# EAGLE schematic klon (EAGLE 9.6.2)
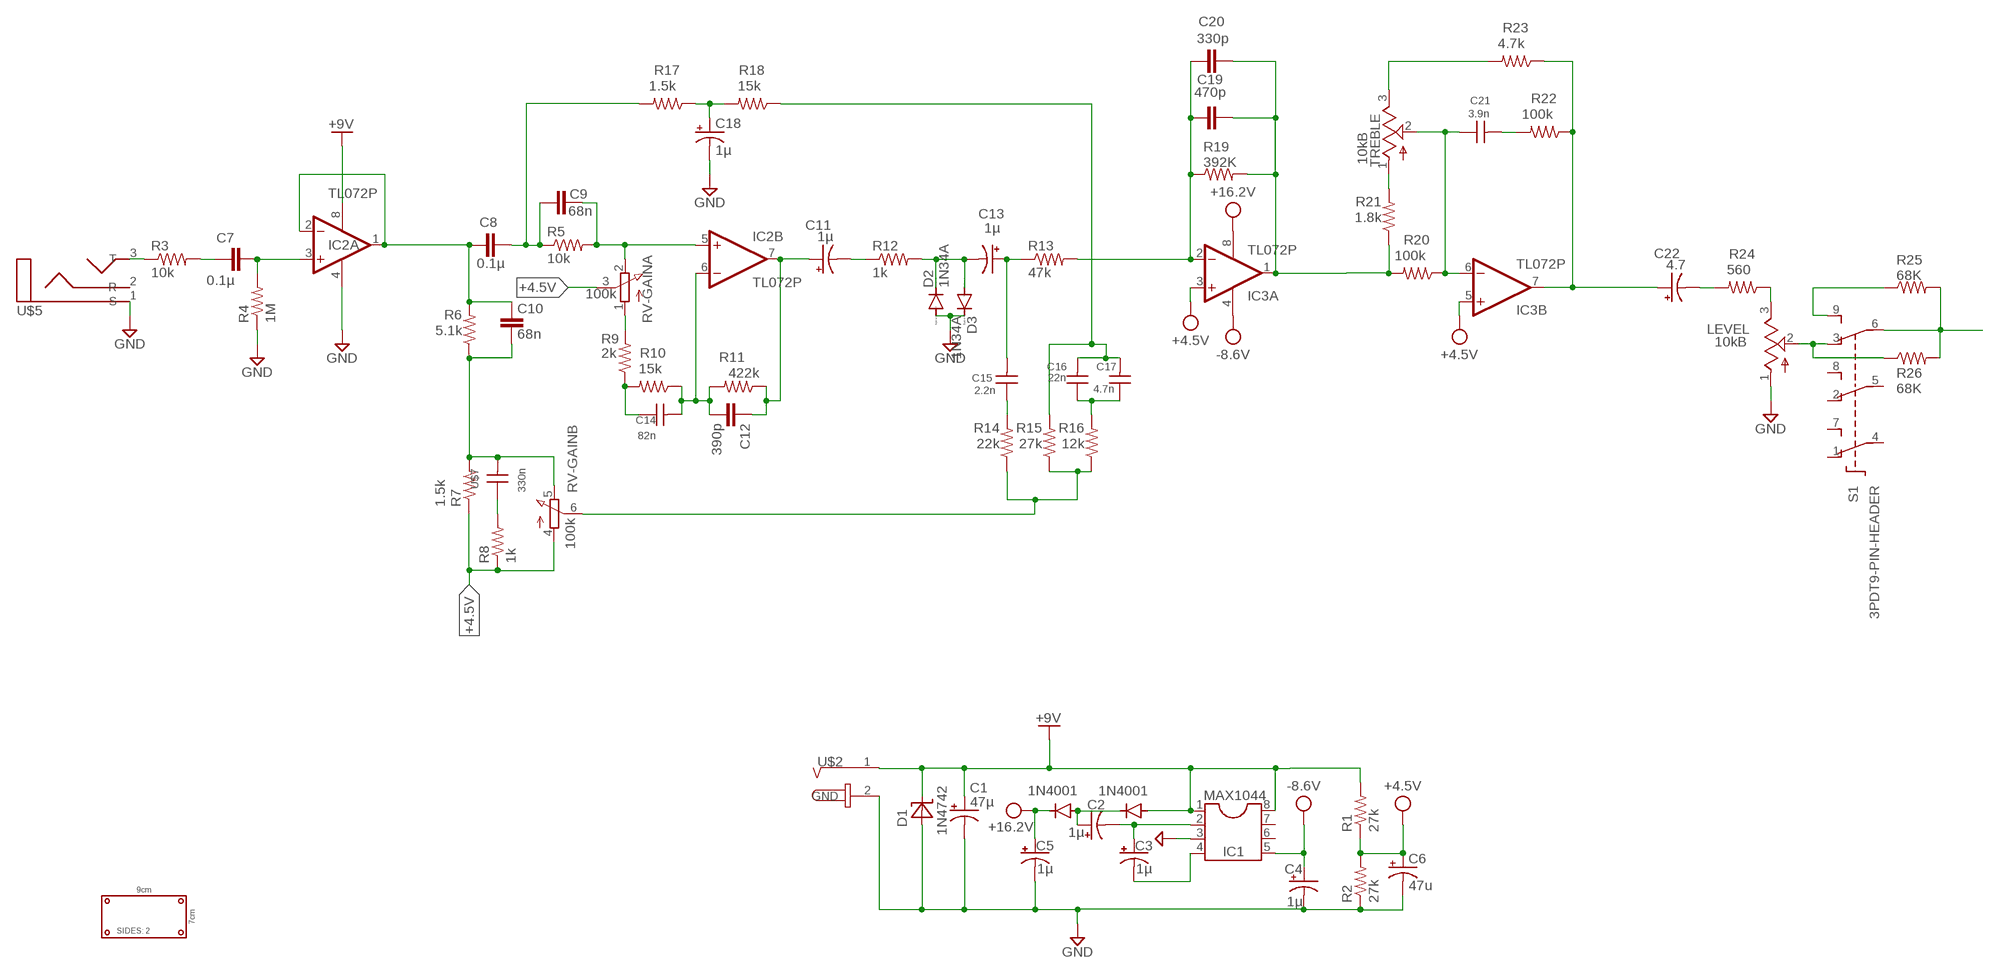
[diagram p0: schematic, sheet 1]

## Parts
C1  47µ  C-E0.1_0.15  [C-E-0.1_0.15]
C2  1µ  C-E0.1_0.15  [C-E-0.1_0.15]
C3  1µ  C-E0.1_0.15  [C-E-0.1_0.15]
C4  1µ  C-E0.1_0.15  [C-E-0.1_0.15]
C5  1µ  C-E0.1_0.15  [C-E-0.1_0.15]
C6  47u  C-E0.1_0.15  [C-E-0.1_0.15]
C7  0.1µ  C10/5  [C10B5]
C8  0.1µ  C10/5  [C10B5]
C9  68n  C10/5  [C10B5]
C10  68n  C10/5  [C10B5]
C11  1µ  C-E0.1_0.15  [C-E-0.1_0.15]
C12  390p  C-CERAMICC-C-0.1_0.05  [C-C-0.1_0.05]
C13  1µ  C-E0.1_0.15  [C-E-0.1_0.15]
C14  82n  C-PP_0.60.2W  [C-PP-0.6_0.2]
C15  2.2n  C-PP_0.40.15  [C-PP-0.4_0.15]
C16  22n  C-PP_0.40.2  [C-PP-0.4_0.2]
C17  4.7n  C-PP_0.40.2  [C-PP-0.4_0.2]
C18  1µ  C-E0.1_0.15  [C-E-0.1_0.15]
C19  470p  C-CERAMICC-C-0.1_0.05  [C-C-0.1_0.05]
C20  330p  C-CERAMICC-C-0.1_0.05  [C-C-0.1_0.05]
C21  3.9n  C-PP_0.40.1  [C-PP-0.4_0.1]
C22  4.7  C-E0.1_0.15  [C-E-0.1_0.15]
D1  1N4742  [DO41-7.6]
D2  1N34A  DIODE-D-7.5  [D-7.5]
D3  1N34A  DIODE-D-7.5  [D-7.5]
IC1  MAX1044  [DIL08]
IC2  TL072P  [DIL08]
IC3  TL072P  [DIL08]
LEVEL  10kB  POT-1X  [1X03]
R1  27k  RESISTOR0204/7  [0204/7]
R2  27k  RESISTOR0204/7  [0204/7]
R3  10k  RESISTOR0204/7  [0204/7]
R4  1M  RESISTOR0204/7  [0204/7]
R5  10k  RESISTOR0204/7  [0204/7]
R6  5.1k  RESISTOR0204/7  [0204/7]
R7  1.5k  RESISTOR0204/7  [0204/7]
R8  1k  RESISTOR0204/7  [0204/7]
R9  2k  RESISTOR0204/7  [0204/7]
R10  15k  RESISTOR0204/7  [0204/7]
R11  422k  RESISTOR0204/7  [0204/7]
R12  1k  RESISTOR0204/7  [0204/7]
R13  47k  RESISTOR0204/7  [0204/7]
R14  22k  RESISTOR0204/7  [0204/7]
R15  27k  RESISTOR0204/7  [0204/7]
R16  12k  RESISTOR0204/7  [0204/7]
R17  1.5k  RESISTOR0204/7  [0204/7]
R18  15k  RESISTOR0204/7  [0204/7]
R19  392K  RESISTOR0204/7  [0204/7]
R20  100k  RESISTOR0204/7  [0204/7]
R21  1.8k  RESISTOR0204/7  [0204/7]
R22  100k  RESISTOR0204/7  [0204/7]
R23  4.7k  RESISTOR0204/7  [0204/7]
R24  560  RESISTOR0204/7  [0204/7]
R25  68K  RESISTOR0204/7  [0204/7]
R26  68K  RESISTOR0204/7  [0204/7]
RV-GAIN  100k  POT-2X  [1X06]
S1  3PDT9-PIN-HEADER  [MA09-1]
TREBLE  10kB  POT-1X  [1X03]
U$1  9x7  GREEN-2-SIDED9X7  [9X7_CM]
U$2  2_1MM-JACK-PLUG  [1X02]
U$3  1N4001  [DO41-7]
U$4  1N4001  [DO41-7]
U$5  INSTRUMENT-JACKPINS  [1X03]
U$7  330n  C-PP_0.60.15W  [C-PP-0.6_0.15]

## Nets
+4.5V: C6.+ IC3.3(A:+IN) IC3.5(B:+IN) R1.1 R2.2 R7.1 R8.1 RV-GAIN.3(A:S) RV-GAIN.4(B:A)
+9V: C1.+ D1.C IC1.1 IC1.8 IC2.8(P:V+) R1.2 U$2.1(+9V) U$4.A
+16.2V: C5.+ IC3.8(P:V+) U$3.C
-8.6V: C4.+ IC1.5 IC3.4(P:V-)
GND: C1.- C4.- C5.- C6.- C18.- D1.A D2.A D3.C IC1.3 IC2.4(P:V-) LEVEL.1 R2.1 R4.1 U$2.2(GND) U$5.1(S)
N$1: C2.- C3.+ IC1.2
N$2: C3.- IC1.4
N$3: C7.1 R3.2
N$4: C2.+ U$3.A U$4.C
N$5: R3.1 U$5.3(T)
N$6: C7.2 IC2.3(A:+IN) R4.2
N$7: R8.2 U$7.1
N$8: C8.2 C9.1 R5.1 R17.2
N$9: C9.2 IC2.5(B:+IN) R5.2 RV-GAIN.2(A:E)
N$10: C8.1 C10.2 IC2.1(A:OUT) IC2.2(A:-IN) R6.2
N$11: C10.1 R6.1 R7.2 RV-GAIN.5(B:E) U$7.2
N$12: R9.2 RV-GAIN.1(A:A)
N$13: C14.1 R9.1 R10.2
N$14: C11.- R12.1
N$15: C13.- D2.C D3.A R12.2
N$16: C11.+ C12.1 IC2.7(B:OUT) R11.1
N$17: C12.2 C14.2 IC2.6(B:-IN) R10.1 R11.2
N$18: C13.+ C15.2 R13.1
N$19: C15.1 R14.2
N$20: R14.1 R15.1 R16.1 RV-GAIN.6(B:S)
N$21: C16.1 C17.1 R16.2
N$22: C16.2 C17.2 R15.2 R18.1
N$23: C18.+ R17.1 R18.2
N$24: R21.2 TREBLE.1
N$25: C19.2 C20.2 IC3.1(A:OUT) R19.2 R20.2 R21.1
N$26: C19.1 C20.1 IC3.2(A:-IN) R13.2 R19.1
N$27: C21.1 IC3.6(B:-IN) R20.1 TREBLE.2
N$28: C22.+ IC3.7(B:OUT) R22.1 R23.1
N$29: R23.2 TREBLE.3
N$30: C21.2 R22.2
N$31: C22.- R24.2
N$32: LEVEL.3 R24.1
N$33: LEVEL.2 R26.1 S1.3(O3)
N$34: R25.1 S1.9(S3)
N$35: R25.2 R26.2 S1.6(P3)
Unconnected: IC1.6 IC1.7 S1.1(O1) S1.2(O2) S1.4(P1) S1.5(P2) S1.7(S1) S1.8(S2) U$5.2(R)

## Library data of the parts
C1-C6 C11 C13 C18 C22 = pedal-library:C-E: POLARIZED CAPACITOR, American symbol
C7-C10 = capacitor-wima:C: CAPACITOR naming: grid - package width
C12 C19 C20 = pedal-library:C-CERAMIC: CAPACITOR, European symbol; SPICEPREFIX: C
C14 U$7 = pedal-library:C-PP_0.6; PITCH: 0.6in
C15-C17 C21 = pedal-library:C-PP_0.4; PITCH: 0.4in
D1 = pedal-library:1N474*: 12V, 1W zener Check prices <https://pricing.snapeda.com/parts/1N4742/EIC%20Semiconductor/view-part?ref=eda>; AVAILABILITY: Warning; DESCRIPTION: Zener Diode 12V 1W ±5% Through Hole DO-41; MF: EIC Semiconductor; MP: 1N4742; PACKAGE: DO-41 EIC Semiconductor; PRICE: None
D2 D3 = diode:DIODE-: DIODE
IC1 = MAX1044:MAX1044; AVAILABILITY: Unavailable; DESCRIPTION: Charge Pump Switching Regulator IC Positive or Negative Fixed -Vin, nVin, Vin/2 1 Output 20mA 8-SOIC (0.154, 3.90mm Width); MF: Maxim Integrated; MP: MAX1044; PACKAGE: DIP-8 Maxim Integrated; PRICE: None
IC2 IC3 = linear:TL072: OP AMP
LEVEL TREBLE = pedal-library:POT-1X
R1-R26 = pedal-library:RESISTOR: RESISTOR, American symbol; SPICEPREFIX: R
RV-GAIN = pedal-library:POT-2X: 2 Gang Potentiometer
S1 = pedal-library:3PDT: 3PDT 9 pin footswitch SF17020F-0302-21R-L Source: 3PDT.jpg
U$1 = perfboards:GREEN-2-SIDED: Green 2 sided perfboard; DEPTH: 1.6mm; HEIGHT: 7cm; HOLE_DIA: 3.7mm; PITCH: 0.1in; SIDES: 2; WIDTH: 9cm
U$2 = pedal-library:2_1MM-JACK-PLUG: 2.1mm 9V Jack Plug
U$3 U$4 = pedal-library:1N400*
U$5 = pedal-library:INSTRUMENT-JACK